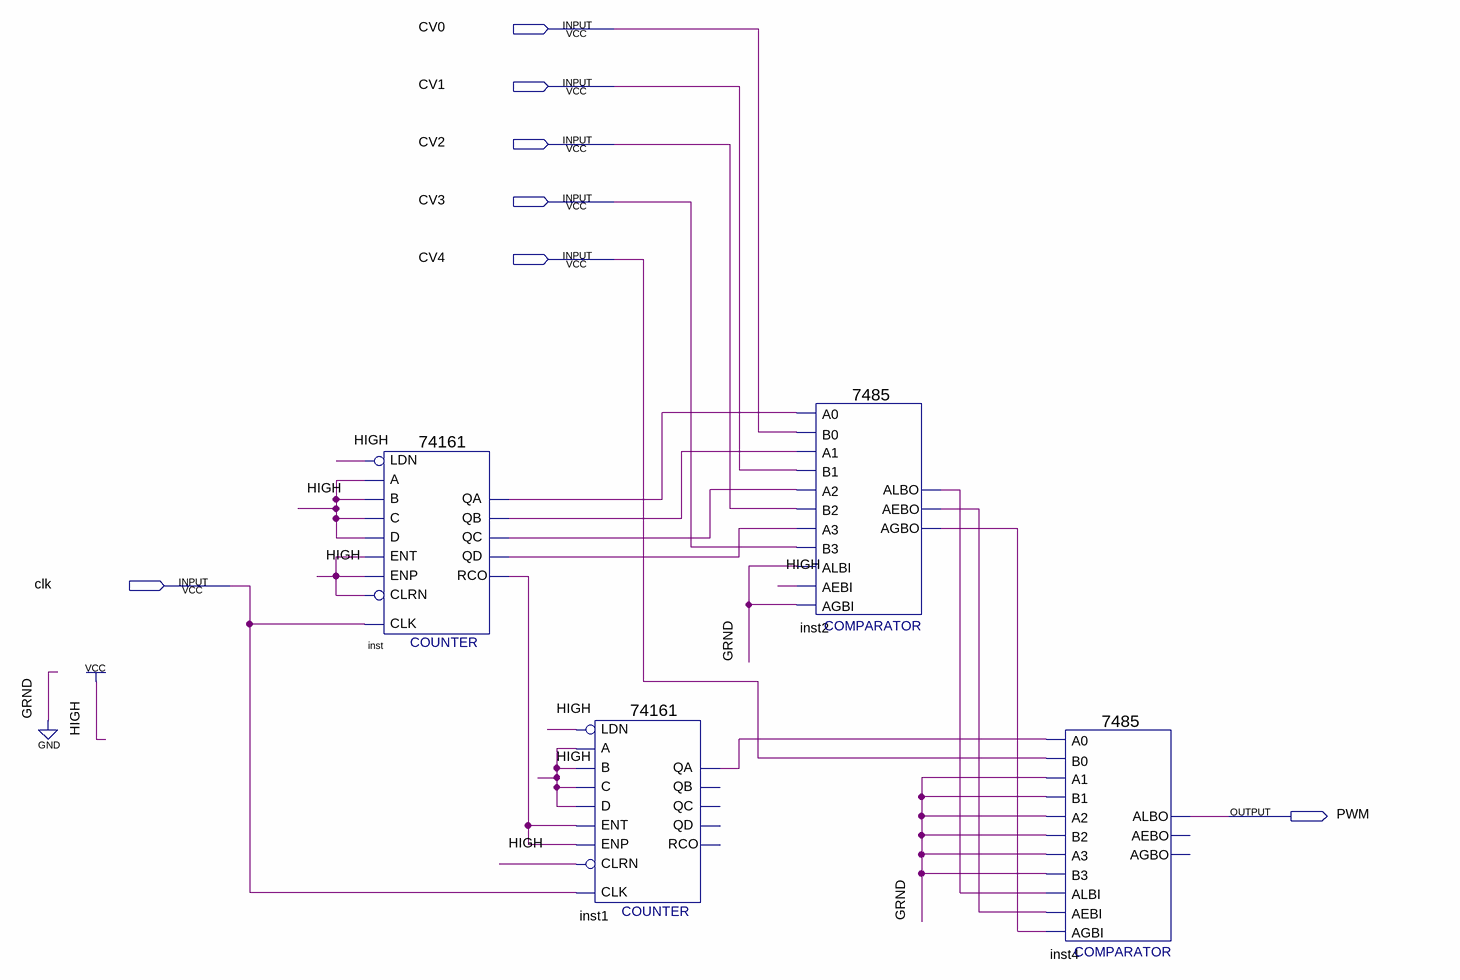
[diagram p0: schematic sheet]
// Quartus schematic pwm.bdf as structural Verilog: 4 symbols, 7 pins
module pwm (
  input  CV0,
  input  CV1,
  input  CV2,
  input  CV3,
  input  CV4,
  input  clk,
  output PWM
);

  wire inst1_qa, inst2_aebo, inst2_agbo, inst2_albo, inst_qa, inst_qb, inst_qc, inst_qd, inst_rco;

  \74161  inst (
    .CLRN(1'b1), .CLK(clk), .ENP(1'b1), .LDN(1'b1), .A(1'b1), .D(1'b1), .ENT(1'b1), .B(1'b1), .C(1'b1),
    .QD(inst_qd), .QC(inst_qc), .QB(inst_qb), .QA(inst_qa), .RCO(inst_rco));
  \74161  inst1 (
    .CLRN(1'b1), .CLK(clk), .ENP(inst_rco), .LDN(1'b1), .A(1'b1), .D(1'b1), .ENT(inst_rco), .B(1'b1),
    .C(1'b1), .QA(inst1_qa));  // open: QD, QC, QB, RCO
  \7485  inst2 (
    .A3(inst_qd), .B2(CV2), .A2(inst_qc), .AEBI(1'b1), .AGBI(1'b0), .ALBI(1'b0), .A0(inst_qa), .B0(CV0),
    .B3(CV3), .A1(inst_qb), .B1(CV1), .ALBO(inst2_albo), .AGBO(inst2_agbo), .AEBO(inst2_aebo));
  \7485  inst4 (
    .A3(1'b0), .B2(1'b0), .A2(1'b0), .AEBI(inst2_aebo), .AGBI(inst2_agbo), .ALBI(inst2_albo), .A0(inst1_qa),
    .B0(CV4), .B3(1'b0), .A1(1'b0), .B1(1'b0), .ALBO(PWM));  // open: AGBO, AEBO
endmodule
